# EAGLE design GPIO Protector (EAGLE 7.4.0)
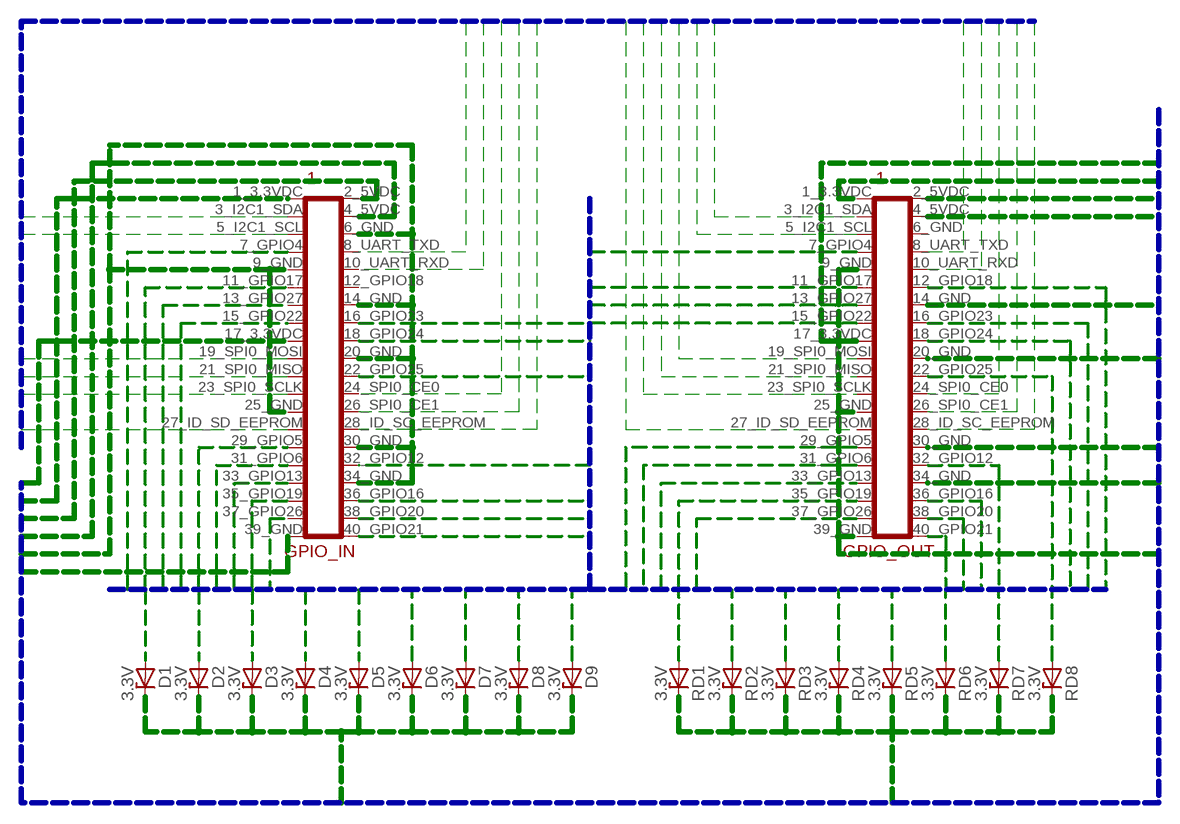
[diagram p0: schematic, sheet 1]

## Parts
D1  3.3V  ZENER-DIODEDO41Z10  [DO41Z10]
D2  3.3V  ZENER-DIODEDO41Z10  [DO41Z10]
D3  3.3V  ZENER-DIODEDO41Z10  [DO41Z10]
D4  3.3V  ZENER-DIODEDO41Z10  [DO41Z10]
D5  3.3V  ZENER-DIODEDO41Z10  [DO41Z10]
D6  3.3V  ZENER-DIODEDO41Z10  [DO41Z10]
D7  3.3V  ZENER-DIODEDO41Z10  [DO41Z10]
D8  3.3V  ZENER-DIODEDO41Z10  [DO41Z10]
D9  3.3V  ZENER-DIODEDO41Z10  [DO41Z10]
GPIO_IN  RPI_GPIOUPPER  [RPI_GPIO_MALE]
GPIO_OUT  RPI_GPIOUPPER  [RPI_GPIO_MALE]
RD1  3.3V  ZENER-DIODEDO41Z10  [DO41Z10]
RD2  3.3V  ZENER-DIODEDO41Z10  [DO41Z10]
RD3  3.3V  ZENER-DIODEDO41Z10  [DO41Z10]
RD4  3.3V  ZENER-DIODEDO41Z10  [DO41Z10]
RD5  3.3V  ZENER-DIODEDO41Z10  [DO41Z10]
RD6  3.3V  ZENER-DIODEDO41Z10  [DO41Z10]
RD7  3.3V  ZENER-DIODEDO41Z10  [DO41Z10]
RD8  3.3V  ZENER-DIODEDO41Z10  [DO41Z10]

## Nets
3.3VDC1: GPIO_IN.1_3.3VDC GPIO_OUT.1_3.3VDC
3.3VDC2: GPIO_IN.17_3.3VDC GPIO_OUT.17_3.3VDC
5VDC1: GPIO_IN.2_5VDC GPIO_OUT.2_5VDC
5VDC2: GPIO_IN.4_5VDC GPIO_OUT.4_5VDC
GND: D1.C D2.C D3.C D4.C D5.C D6.C D7.C D8.C D9.C GPIO_IN.6_GND GPIO_IN.9_GND GPIO_IN.14_GND GPIO_IN.20_GND GPIO_IN.25_GND GPIO_IN.30_GND GPIO_IN.34_GND GPIO_IN.39_GND GPIO_OUT.9_GND GPIO_OUT.14_GND GPIO_OUT.20_GND GPIO_OUT.25_GND GPIO_OUT.30_GND GPIO_OUT.34_GND GPIO_OUT.39_GND RD1.C RD2.C RD3.C RD4.C RD5.C RD6.C RD7.C RD8.C
GPIO4: D1.A GPIO_IN.7_GPIO4 GPIO_OUT.7_GPIO4
GPIO5: D5.A GPIO_IN.29_GPIO5 GPIO_OUT.29_GPIO5
GPIO6: D6.A GPIO_IN.31_GPIO6 GPIO_OUT.31_GPIO6
GPIO12: GPIO_IN.32_GPIO12 GPIO_OUT.32_GPIO12 RD5.A
GPIO13: D7.A GPIO_IN.33_GPIO13 GPIO_OUT.33_GPIO13
GPIO16: GPIO_IN.36_GPIO16 GPIO_OUT.36_GPIO16 RD6.A
GPIO17: D2.A GPIO_IN.11_GPIO17 GPIO_OUT.11_GPIO17
GPIO18: GPIO_OUT.12_GPIO18 RD1.A
GPIO19: D8.A GPIO_IN.35_GPIO19 GPIO_OUT.35_GPIO19
GPIO20: GPIO_IN.38_GPIO20 GPIO_OUT.38_GPIO20 RD7.A
GPIO21: GPIO_IN.40_GPIO21 GPIO_OUT.40_GPIO21 RD8.A
GPIO22: D4.A GPIO_IN.15_GPIO22 GPIO_OUT.15_GPIO22
GPIO23: GPIO_IN.16_GPIO23 GPIO_OUT.16_GPIO23 RD2.A
GPIO24: GPIO_IN.18_GPIO24 GPIO_OUT.18_GPIO24 RD3.A
GPIO25: GPIO_IN.22_GPIO25 GPIO_OUT.22_GPIO25 RD4.A
GPIO26: D9.A GPIO_IN.37_GPIO26 GPIO_OUT.37_GPIO26
GPIO27: D3.A GPIO_IN.13_GPIO27 GPIO_OUT.13_GPIO27
I2C1_SCL: GPIO_IN.5_I2C1_SCL GPIO_OUT.5_I2C1_SCL
I2C1_SDA: GPIO_IN.3_I2C1_SDA GPIO_OUT.3_I2C1_SDA
ID_SC: GPIO_IN.28_ID_SC_EEPROM GPIO_OUT.28_ID_SC_EEPROM
ID_SD: GPIO_IN.27_ID_SD_EEPROM(27_ID_SC_EEPROM) GPIO_OUT.27_ID_SD_EEPROM(27_ID_SC_EEPROM)
SPI0_CE0: GPIO_IN.24_SPI0_CE0 GPIO_OUT.24_SPI0_CE0
SPI0_CE1: GPIO_IN.26_SPI0_CE1 GPIO_OUT.26_SPI0_CE1
SPI0_MOSI: GPIO_IN.19_SPI0_MOSI GPIO_OUT.19_SPI0_MOSI
SPI0_SCLK: GPIO_IN.23_SPI0_SCLK GPIO_OUT.23_SPI0_SCLK
SPIO_MISO: GPIO_IN.21_SPI0_MISO GPIO_OUT.21_SPI0_MISO
UART_RXD: GPIO_IN.10_UART_RXD(10_UART0_RXD) GPIO_OUT.10_UART_RXD(10_UART0_RXD)
UART_TXD: GPIO_IN.8_UART_TXD(8_UART0_TXD) GPIO_OUT.8_UART_TXD(8_UART0_TXD)
Unconnected: GPIO_IN.12_GPIO18

## Buses
3.3VDC1,3.3VDC2,5VDC1,5VDC2,GND
I2C1_SDA,I2C1_SCL,SPI0_MOSI,SPIO_MISO,SPI0_SCLK,SPI0_CE0,SPI0_CE1,ID_SD,ID_SC,UART_TXD,UART_RXD
GPIO4,GPIO5,GPIO6,GPIO12,GPIO13,GPIO14,GPIO16,GPIO17,GPIO18,GPIO19,GPIO20,GPIO21,GPIO22,GPIO23,GPIO24,GPIO25,GPIO26,GPIO27

## Power pins joined to a net without a drawn wire
6_GND: GPIO_OUT.6_GND

## Library data of the parts
D1-D9 RD1-RD8 = diode:ZENER-DIODE: Z-Diode
GPIO_IN GPIO_OUT = connectors:RPI_GPIO*: GPIO Connector for Raspberry Pi.

## Board
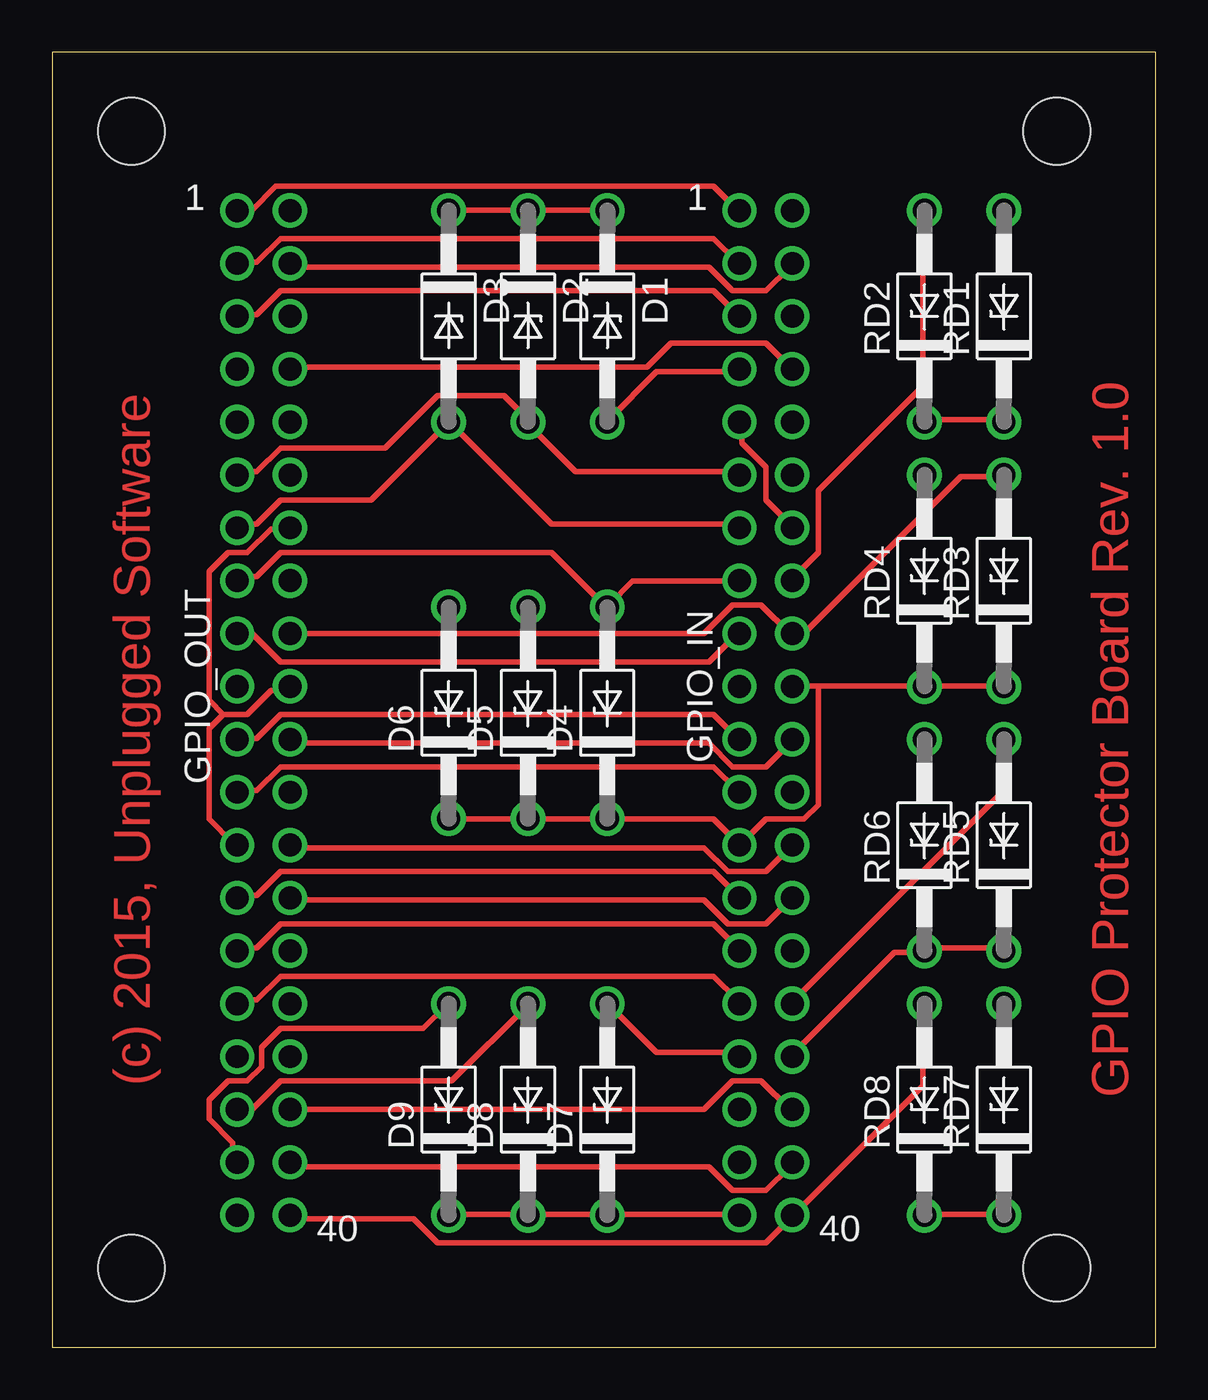
[diagram p1: board, top side]
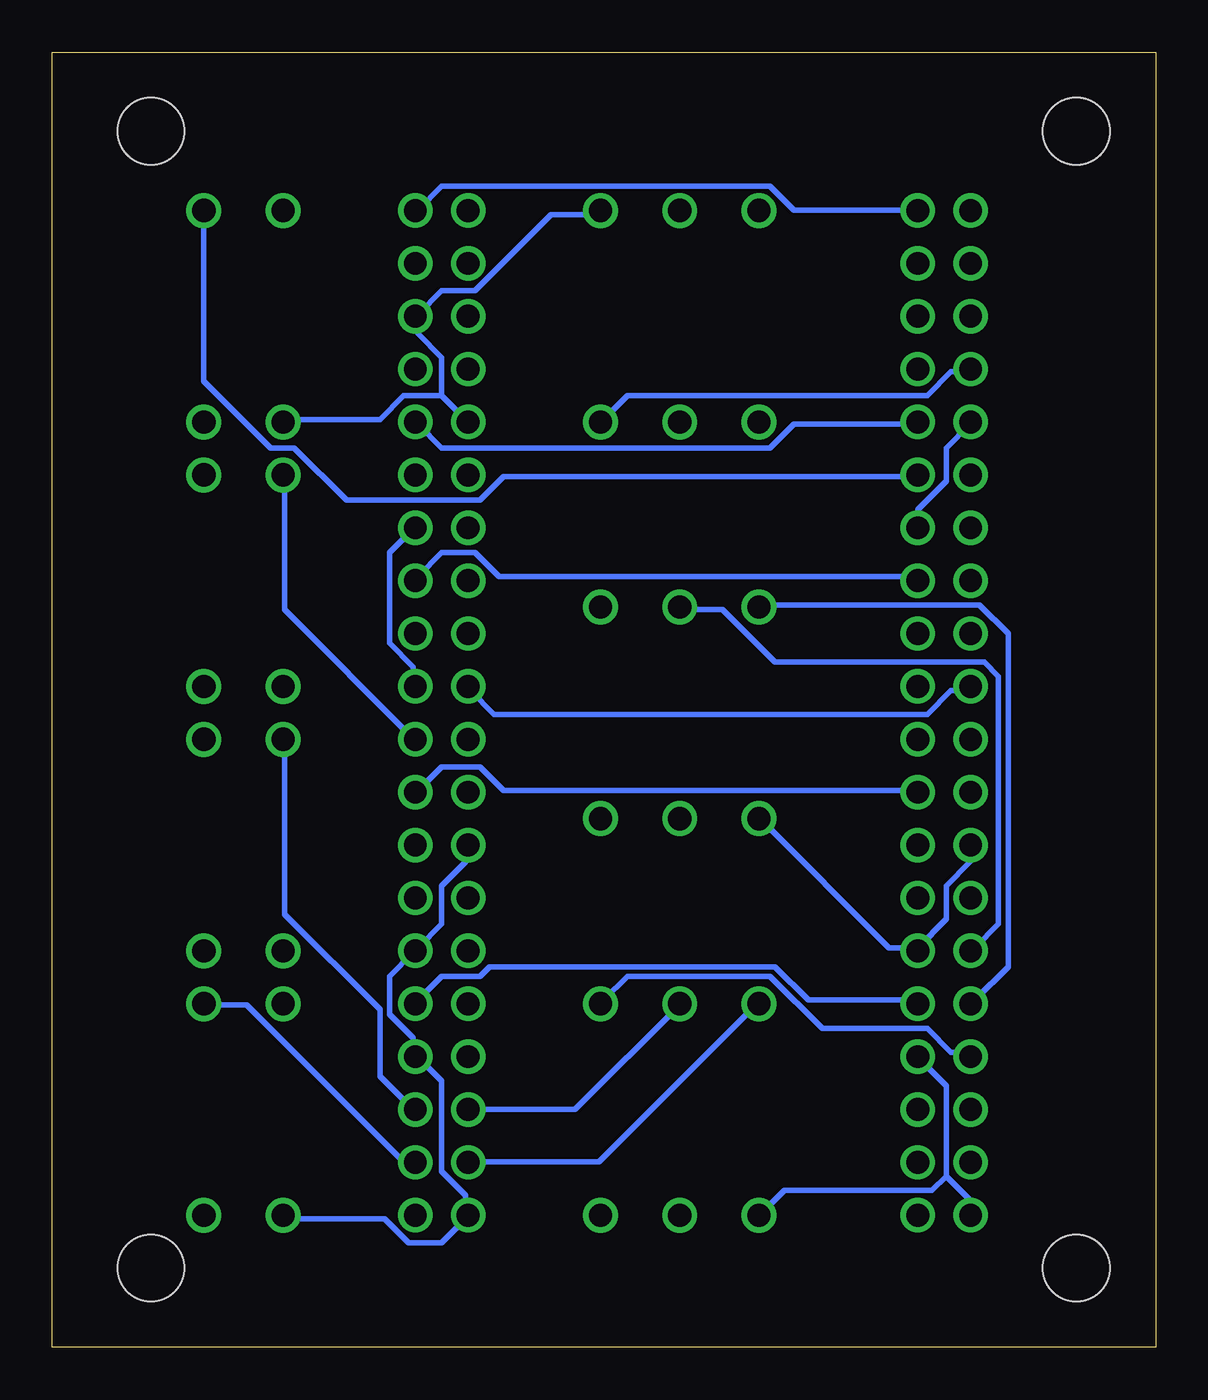
[diagram p2: board, bottom side, seen from below]

Size 53.01 x 62.22 mm. Coordinates in mm from the lower left corner, seen from the top.
Outline: 0,0 53.01,0 53.01,62.22 0,62.22 0,0
Copper layers (1*16): Top 0.035mm / dielectric 1.5mm / Bottom 0.035mm
Design rules "default": minimum track width 10mil, minimum drill 24mil, track to track 8mil, track to pad 8mil, pad to pad 8mil, via to via 8mil, smd to smd 8mil, copper to edge 40mil, drill to drill 8mil, minimum pad ring 10mil, minimum via ring 8mil, stop-mask expansion 4mil, vias tented up to drill 0mil, thermal gap 10mil
Holes 3.2 mm at 3.81,3.81 48.26,3.81 48.26,58.42 3.81,58.42

### Footprints (pad centres in the part's own frame; a part is rotated, then mirrored left to right if it is on the bottom)
DO41Z10 = drill 1.118: A 5.08,0; C -5.08,0
RPI_GPIO_MALE = drill 1.1: 1_3.3VDC 0,22.86; 2_5VDC 2.54,22.86; 3_I2C1_SDA 0,20.32; 4_5VDC 2.54,20.32; 5_I2C1_SCL 0,17.78; 6_GND 2.54,17.78; 7_GPIO4 0,15.24; 8_UART_TXD 2.54,15.24; 9_GND 0,12.7; 10_UART_RXD 2.54,12.7; 11_GPIO17 0,10.16; 12_GPIO18 2.54,10.16; 13_GPIO27 0,7.62; 14_GND 2.54,7.62; 15_GPIO22 0,5.08; 16_GPIO23 2.54,5.08; 17_3.3VDC 0,2.54; 18_GPIO24 2.54,2.54; 19_SPI0_MOSI 0,0; 20_GND 2.54,0; 21_SPI0_MISO 0,-2.54; 22_GPIO25 2.54,-2.54; 23_SPI0_SCLK 0,-5.08; 24_SPI0_CE0 2.54,-5.08; 25_GND 0,-7.62; 26_SPI0_CE1 2.54,-7.62; 27_ID_SD_EEPROM 0,-10.16; 28_ID_SC_EEPROM 2.54,-10.16; 29_GPIO5 0,-12.7; 30_GND 2.54,-12.7; 31_GPIO6 0,-15.24; 32_GPIO12 2.54,-15.24; 33_GPIO13 0,-17.78; 34_GND 2.54,-17.78; 35_GPIO19 0,-20.32; 36_GPIO16 2.54,-20.32; 37_GPIO26 0,-22.86; 38_GPIO20 2.54,-22.86; 39_GND 0,-25.4; 40_GPIO21 2.54,-25.4

### Placement (x,y rotation side)
D1  26.67,49.53 270 top
D2  22.86,49.53 270 top
D3  19.05,49.53 270 top
D4  26.67,30.48 90 top
D5  22.86,30.48 90 top
D6  19.05,30.48 90 top
D7  26.67,11.43 90 top
D8  22.86,11.43 90 top
D9  19.05,11.43 90 top
GPIO_IN  33.02,31.75 0 top
GPIO_OUT  8.89,31.75 0 top
RD1  45.72,49.53 90 top
RD2  41.91,49.53 90 top
RD3  45.72,36.83 90 top
RD4  41.91,36.83 90 top
RD5  45.72,24.13 90 top
RD6  41.91,24.13 90 top
RD7  45.72,11.43 90 top
RD8  41.91,11.43 90 top

### Tracks (layer width: path | path; a pad name or v marks a point on that pad's centre or on a via)
3.3VDC1
  Top 0.254: GPIO_OUT.1_3.3VDC 8.91,54.63 9.6,54.63 10.74,55.78 31.77,55.78 32.92,54.63 GPIO_IN.1_3.3VDC
3.3VDC2
  Top 0.254: GPIO_OUT.17_3.3VDC 9.6,34.29 10.97,32.92 31.55,32.92 32.92,34.29 GPIO_IN.17_3.3VDC
5VDC1
  Bottom 0.254: GPIO_OUT.2_5VDC 11.43,54.63 17.37,54.63 18.52,55.78 34.29,55.78 35.43,54.63 GPIO_IN.2_5VDC
5VDC2
  Top 0.254: GPIO_OUT.4_5VDC 11.43,51.89 31.55,51.89 32.69,50.75 34.29,50.75 35.43,51.89 GPIO_IN.4_5VDC
GND
  Top 0.254: 36.8,31.77 41.83,31.77 RD4.C 42.06,31.77 45.72,31.77 RD3.C | 36.8,31.77 35.66,31.77 GPIO_IN.20_GND | 22.86,54.63 19.2,54.63 D3.C | 22.86,54.63 26.52,54.63 D1.C | 22.86,54.63 D2.C | RD2.C 42.06,44.58 45.72,44.58 RD1.C | GPIO_IN.9_GND 33.15,44.35 33.15,43.43 34.29,42.29 34.29,40.69 35.43,39.55 GPIO_IN.14_GND | RD8.C 42.06,6.4 45.72,6.4 RD7.C | 22.86,6.4 19.2,6.4 D9.C | GPIO_IN.39_GND 32.92,6.4 26.75,6.4 D7.C 26.52,6.4 22.86,6.4 | 22.86,6.4 D8.C | 8.23,30.4 9.37,30.4 10.52,31.55 11.43,31.55 GPIO_OUT.20_GND | 8.23,30.4 7.54,29.72 7.54,25.38 8.69,24.23 GPIO_OUT.25_GND | 8.23,30.4 7.54,31.09 7.54,37.26 8.46,38.18 9.37,38.18 10.52,39.32 11.43,39.32 GPIO_OUT.14_GND | 22.86,25.38 19.2,25.38 D6.C | 22.86,25.38 26.52,25.38 D4.C 26.75,25.38 31.77,25.38 GPIO_IN.25_GND 33.15,24.23 34.29,25.38 36.12,25.38 36.8,26.06 36.8,31.77 | 22.86,25.38 D5.C | RD5.C 45.72,19.2 42.06,19.2 RD6.C 41.83,18.97 40.46,18.97 35.66,14.17 GPIO_IN.34_GND
  Bottom 0.254: 34.29,45.72 34.29,47.55 35.43,48.69 35.43,49.38 GPIO_IN.6_GND 35.43,49.61 34.29,50.75 32.69,50.75 29.03,54.41 26.75,54.41 D1.C | GPIO_IN.9_GND 34.29,45.72 | 34.29,45.72 36.12,45.72 37.26,44.58 41.83,44.58 RD2.C | GPIO_IN.20_GND 35.66,31.77 35.66,32.69 36.8,33.83 36.8,38.18 35.66,39.32 GPIO_IN.14_GND | 10.06,8.23 8.91,7.09 8.91,6.4 GPIO_OUT.39_GND | 10.06,8.23 10.06,12.57 11.43,13.95 GPIO_OUT.34_GND | RD8.C 41.83,6.17 37.03,6.17 35.89,5.03 34.29,5.03 33.15,6.17 GPIO_IN.39_GND 33.15,6.4 33.15,7.32 34.29,8.46 34.29,12.8 35.43,13.95 GPIO_IN.34_GND 35.66,14.17 35.66,14.86 36.8,16 36.8,17.83 35.66,18.97 GPIO_IN.30_GND 35.43,19.2 34.29,20.34 34.29,22.17 33.15,23.32 33.15,24 GPIO_IN.25_GND | 10.06,8.23 10.74,7.54 17.83,7.54 18.97,6.4 D9.C | GPIO_OUT.14_GND 11.43,40.23 10.06,41.6 10.06,43.2 8.91,44.35 GPIO_OUT.9_GND | 11.43,19.2 10.06,20.57 10.06,22.17 8.91,23.32 8.91,24 GPIO_OUT.25_GND | 11.43,19.2 12.8,19.2 18.97,25.38 D6.C | 11.43,19.2 GPIO_OUT.30_GND
GPIO4
  Top 0.254: GPIO_IN.7_GPIO4 32.92,46.86 29.03,46.86 26.75,44.58 D1.A
  Bottom 0.254: GPIO_OUT.7_GPIO4 8.91,46.86 9.83,46.86 10.97,45.72 25.38,45.72 26.52,44.58 D1.A
GPIO5
  Top 0.254: GPIO_OUT.29_GPIO5 8.91,19.2 9.83,19.2 10.97,20.34 31.77,20.34 32.92,19.2 GPIO_IN.29_GPIO5
  Bottom 0.254: D5.A 22.86,35.43 20.8,35.43 18.29,32.92 8.23,32.92 7.54,32.23 7.54,20.34 8.69,19.2 GPIO_OUT.29_GPIO5
GPIO6
  Top 0.254: GPIO_OUT.31_GPIO6 8.91,16.69 9.83,16.69 10.97,17.83 31.77,17.83 32.92,16.69 GPIO_IN.31_GPIO6
  Bottom 0.254: D6.A 18.97,35.66 8.46,35.66 7.09,34.29 7.09,18.29 8.69,16.69 GPIO_OUT.31_GPIO6
GPIO12
  Top 0.254: RD5.A 45.72,26.75 35.66,16.69 GPIO_IN.32_GPIO12
  Bottom 0.254: GPIO_OUT.32_GPIO12 11.43,16.69 16.69,16.69 18.29,18.29 32,18.29 32.46,17.83 34.29,17.83 35.43,16.69 GPIO_IN.32_GPIO12
GPIO13
  Top 0.254: GPIO_IN.33_GPIO13 32.92,14.17 29.03,14.17 26.75,16.46 D7.A
  Bottom 0.254: GPIO_OUT.33_GPIO13 8.91,14.17 9.83,14.17 10.97,15.32 16,15.32 18.52,17.83 25.38,17.83 26.52,16.69 D7.A
GPIO16
  Top 0.254: GPIO_OUT.36_GPIO16 31.32,11.43 32.69,12.8 34.06,12.8 35.43,11.43 GPIO_IN.36_GPIO16
  Bottom 0.254: RD6.A 41.83,29.03 41.83,20.8 37.26,16.23 37.26,13.03 35.66,11.43 GPIO_IN.36_GPIO16
GPIO17
  Top 0.254: GPIO_OUT.11_GPIO17 8.91,42.06 9.83,42.06 10.97,43.2 16,43.2 18.52,45.72 21.72,45.72 22.86,44.58 D2.A 22.86,44.35 25.15,42.06 32.92,42.06 GPIO_IN.11_GPIO17
GPIO18
  Bottom 0.254: RD1.A 45.72,46.41 42.52,43.2 41.38,43.2 38.86,40.69 32.46,40.69 31.32,41.83 11.43,41.83 GPIO_OUT.12_GPIO18
GPIO19
  Top 0.254: GPIO_OUT.35_GPIO19 9.6,11.43 10.97,12.8 19.2,12.8 22.86,16.46 D8.A
  Bottom 0.254: GPIO_IN.35_GPIO19 27.89,11.43 22.86,16.46 D8.A
GPIO20
  Top 0.254: GPIO_OUT.38_GPIO20 11.43,8.69 31.55,8.69 32.69,7.54 34.29,7.54 35.43,8.69 GPIO_IN.38_GPIO20
  Bottom 0.254: RD7.A 45.72,16.46 43.66,16.46 36.12,8.91 35.66,8.91 GPIO_IN.38_GPIO20
GPIO21
  Top 0.254: GPIO_OUT.40_GPIO21 11.43,6.17 17.37,6.17 18.52,5.03 34.29,5.03 35.43,6.17 GPIO_IN.40_GPIO21 35.66,6.4 41.83,12.57 41.83,16.46 RD8.A
GPIO22
  Top 0.254: GPIO_OUT.15_GPIO22 8.91,37.03 9.83,37.03 10.97,38.18 24,38.18 26.52,35.66 D4.A 26.75,35.66 27.89,36.8 32.92,36.8 GPIO_IN.15_GPIO22
GPIO23
  Top 0.254: RD2.A 41.83,54.41 41.83,46.18 36.8,41.15 36.8,38.18 35.66,37.03 GPIO_IN.16_GPIO23
  Bottom 0.254: GPIO_OUT.16_GPIO23 11.43,37.03 31.55,37.03 32.69,38.18 34.29,38.18 35.43,37.03 GPIO_IN.16_GPIO23
GPIO24
  Top 0.254: GPIO_OUT.18_GPIO24 31.32,34.29 32.69,35.66 34.06,35.66 35.43,34.29 GPIO_IN.18_GPIO24 36.12,34.29 43.66,41.83 45.72,41.83 RD3.A
GPIO25
  Top 0.254: GPIO_OUT.22_GPIO25 11.43,29.03 31.55,29.03 32.69,27.89 34.29,27.89 35.43,29.03 GPIO_IN.22_GPIO25
  Bottom 0.254: RD4.A 41.83,41.83 41.83,35.43 35.66,29.26 GPIO_IN.22_GPIO25
GPIO26
  Top 0.254: GPIO_OUT.37_GPIO26 8.69,8.91 8.69,9.83 7.54,10.97 7.54,11.89 8.46,12.8 9.37,12.8 10.06,13.49 10.06,14.4 10.97,15.32 17.83,15.32 18.97,16.46 D9.A
  Bottom 0.254: GPIO_IN.37_GPIO26 32.92,8.91 26.75,8.91 19.2,16.46 D9.A
GPIO27
  Top 0.254: GPIO_OUT.13_GPIO27 8.91,39.55 9.83,39.55 10.97,40.69 15.32,40.69 18.97,44.35 D3.A 19.2,44.35 24,39.55 32.92,39.55 GPIO_IN.13_GPIO27
I2C1_SCL
  Top 0.254: GPIO_OUT.5_I2C1_SCL 8.91,49.61 9.83,49.61 10.97,50.75 31.77,50.75 32.92,49.61 GPIO_IN.5_I2C1_SCL
I2C1_SDA
  Top 0.254: GPIO_OUT.3_I2C1_SDA 8.91,52.12 9.83,52.12 10.97,53.26 31.77,53.26 32.92,52.12 GPIO_IN.3_I2C1_SDA
ID_SC
  Top 0.254: GPIO_OUT.28_ID_SC_EEPROM 11.43,21.49 31.32,21.49 32.46,20.34 34.29,20.34 35.43,21.49 GPIO_IN.28_ID_SC_EEPROM
ID_SD
  Top 0.254: GPIO_OUT.27_ID_SD_EEPROM 8.91,21.72 9.83,21.72 10.97,22.86 31.77,22.86 32.92,21.72 GPIO_IN.27_ID_SD_EEPROM
SPI0_CE0
  Bottom 0.254: GPIO_OUT.24_SPI0_CE0 11.43,26.75 31.32,26.75 32.46,27.89 34.29,27.89 35.43,26.75 GPIO_IN.24_SPI0_CE0
SPI0_CE1
  Top 0.254: GPIO_IN.26_SPI0_CE1 34.29,22.86 32.46,22.86 31.32,24 11.43,24 GPIO_OUT.26_SPI0_CE1
SPI0_MOSI
  Bottom 0.254: GPIO_OUT.19_SPI0_MOSI 8.91,31.55 9.83,31.55 10.97,30.4 31.77,30.4 32.92,31.55 GPIO_IN.19_SPI0_MOSI
SPI0_SCLK
  Top 0.254: GPIO_OUT.23_SPI0_SCLK 8.91,26.75 9.83,26.75 10.97,27.89 31.77,27.89 32.92,26.75 GPIO_IN.23_SPI0_SCLK
SPIO_MISO
  Top 0.254: GPIO_OUT.21_SPI0_MISO 8.91,29.26 9.83,29.26 10.97,30.4 31.77,30.4 32.92,29.26 GPIO_IN.21_SPI0_MISO
UART_RXD
  Bottom 0.254: GPIO_OUT.10_UART_RXD 11.43,44.35 17.37,44.35 18.52,43.2 34.29,43.2 35.43,44.35 GPIO_IN.10_UART_RXD
UART_TXD
  Top 0.254: GPIO_OUT.8_UART_TXD 11.43,47.09 28.57,47.09 29.72,48.23 34.29,48.23 35.43,47.09 GPIO_IN.8_UART_TXD

### Text on the board
Top: (c) 2015, Unplugged Software | GPIO Protector Board Rev. 1.0 | GPIO Protector Board Rev. 1.0